# EAGLE schematic linebotOV (EAGLE 9.6.0)
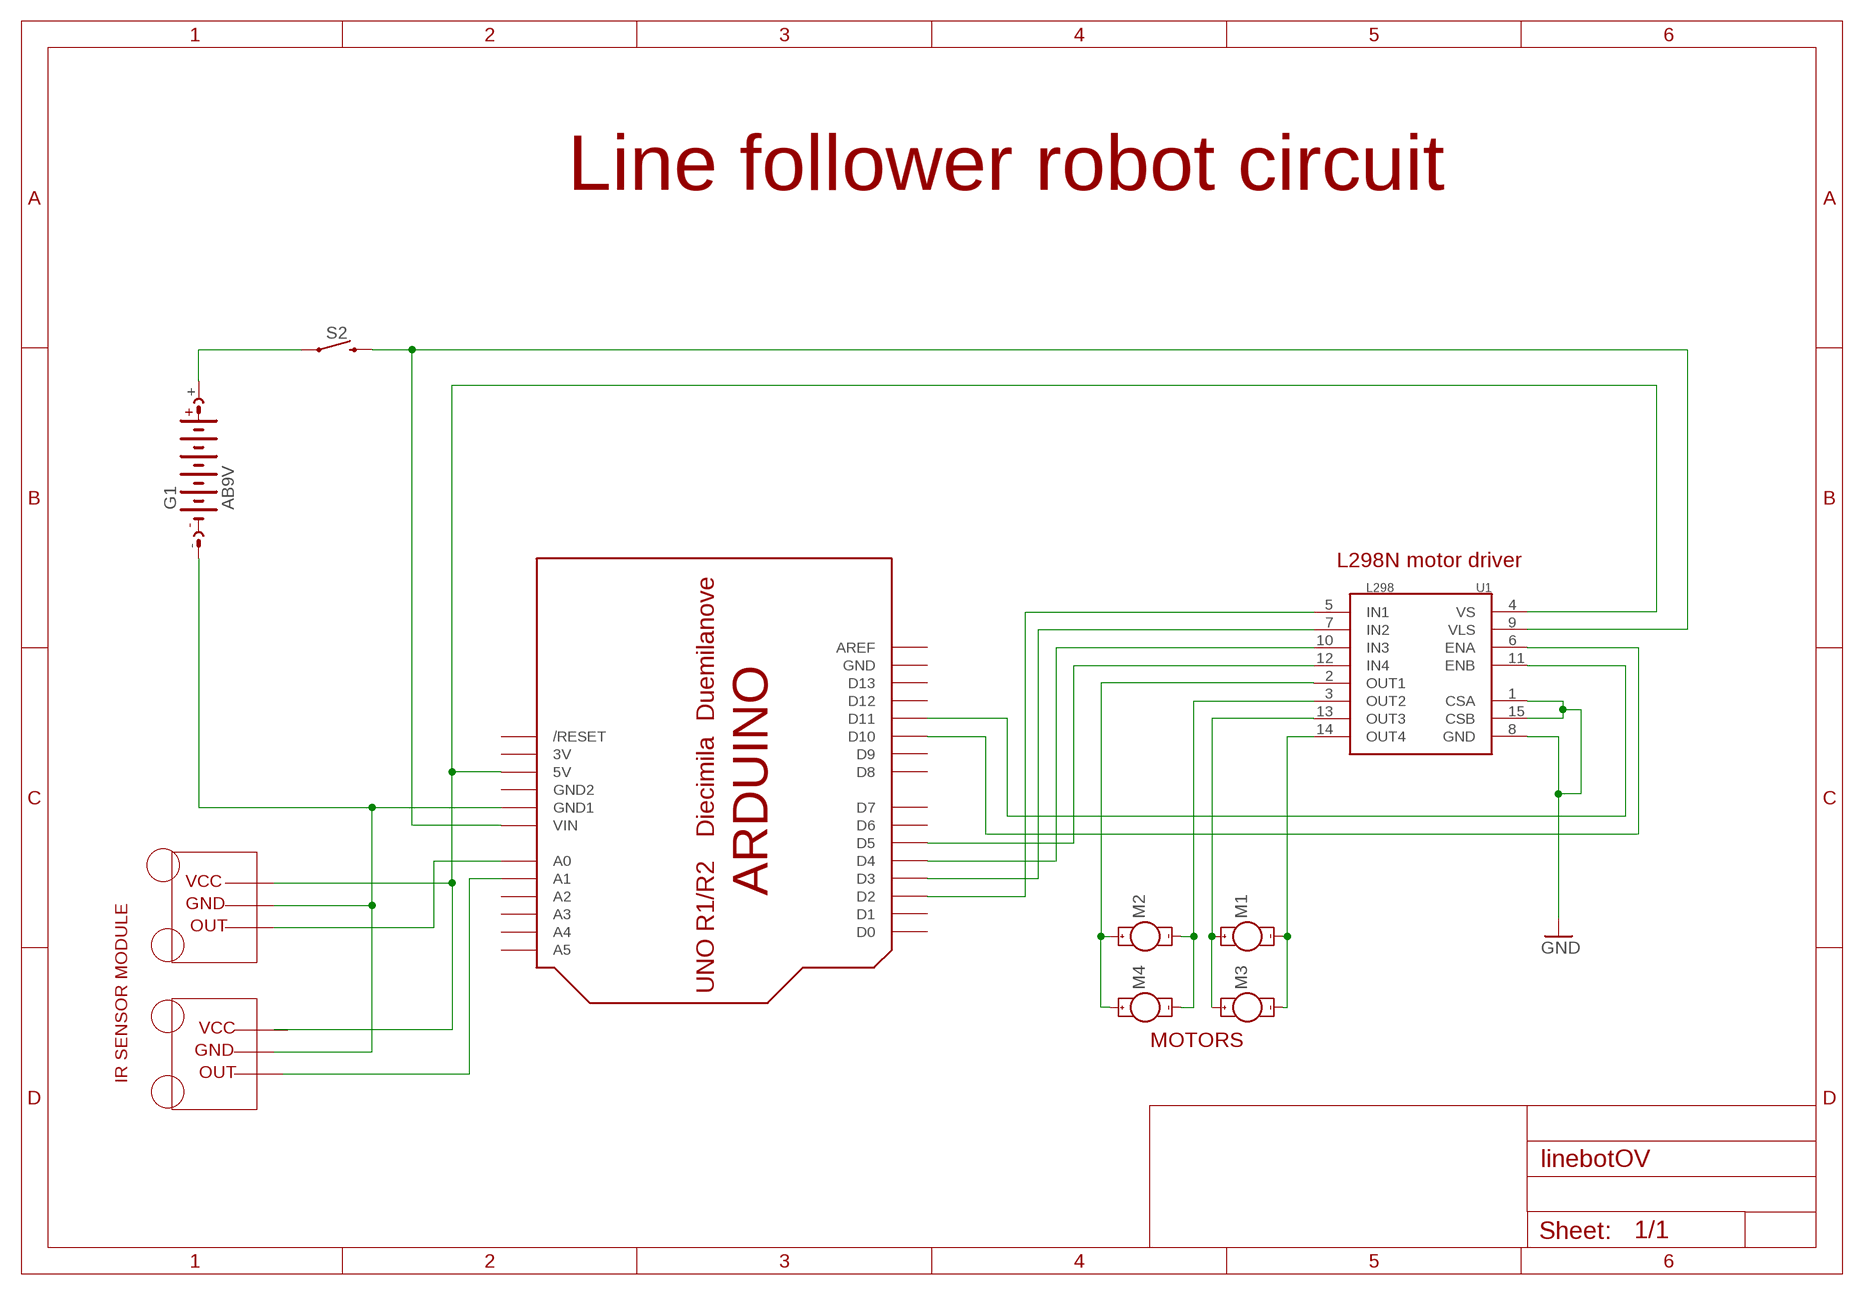
[diagram p0: schematic, sheet 1]

## Parts
G1  AB9V  [AB9V]
M1  MOTOR10MM  [VIBE-MOTOR-10MM]
M2  MOTOR10MM  [VIBE-MOTOR-10MM]
M3  MOTOR10MM  [VIBE-MOTOR-10MM]
M4  MOTOR10MM  [VIBE-MOTOR-10MM]
S2  MOMENTARY-SWITCH-SPST-PTH-6.0MM  [TACTILE_SWITCH_PTH_6.0MM]
U1  L298  [MULTIWATT15]
U$1  ARDUINO-BPLACE  [ARDUINO-BPLACE]

## Nets
GND: U1.1(CSA) U1.8(GND) U1.15(CSB)
N$1: U1.5(IN1) U$1.D2
N$2: U1.7(IN2) U$1.D3
N$3: U1.10(IN3) U$1.D4
N$4: U1.12(IN4) U$1.D5
N$5: U1.6(ENA) U$1.D10
N$6: U1.11(ENB) U$1.D11
N$7: M2.+ M4.+ U1.2(OUT1)
N$8: M2.- M4.- U1.3(OUT2)
N$9: G1.+ S2.1
N$10: S2.3 U1.9(VLS) U$1.VIN
N$11: M1.+ M3.+ U1.13(OUT3)
N$12: M1.- M3.- U1.14(OUT4)
N$13: G1.- U$1.GND1
N$14: U1.4(VS) U$1.5V
N$16: U$1.A0
N$17: U$1.A1
Unconnected: U$1.A2 U$1.A3 U$1.A4 U$1.A5 U$1.AREF U$1.D0 U$1.D1 U$1.D6 U$1.D7 U$1.D8 U$1.D9 U$1.D12 U$1.D13 U$1.RESET(/RESET)

## Notes on the sheet
- Line follower robot circuit
- L298N motor driver
- VCC
- GND
- OUT
- VCC
- MOTORS
- GND
- IR SENSOR MODULE | OUT

## Power pins joined to a net without a drawn wire
3V: U$1.3V
GND: U$1.GND
GND2: U$1.GND2

## Library data of the parts
G1 = battery:AB9V: 9-V BATTERY CLIP
M1-M4 = SparkFun-Electromechanical:MOTOR: Motor (Single-Phase) Two-terminal, single-phase motors. SparkFun Products Vibration Motor <https://www.sparkfun.com/products/8449> (ROB-08449) Physical dimension and wire connections for this powerful vibration motor. Motor has a self adhesive backing.; PROD_ID: COMP-08572; SF_SKU: ROB-08449
S2 = SparkFun-Switches:MOMENTARY-SWITCH-SPST: Momentary Switch (Pushbutton) - SPST Normally-open (NO) SPST momentary switches (buttons, pushbuttons). Variants PTH-12MM - 12mm square, through-hole Momentary Pushbutton Switch - 12mm Square <https://www.sparkfun.com/products/9190> (COM-09190) PTH-6.0MM, PTH-6.0MM-KIT - 6.0mm square, through-hole Mini Pushbutton Switch <https://www.sparkfun.com/products/97> (COM-00097) KIT package intended for soldering kit's - only one side of pads' copper is exposed. PTH-RIGHT-ANGLE-KIT - Right-angle, through-hole Right Angle Tactile Button <https://www.sparkfun.com/products/10791> - Used on SparkFun BigTime Watch Kit <https://www.sparkfun.com/products/11734> SMD-12MM - 12mm square, surface-mount Tactile Button - SMD (12mm) <https://www.sparkfun.com/products/12993> (COM-12993) Used on SparkFun PicoBoard <https://www.sparkfun.com/products/11888> SMD-4.5MM - 4.5mm Square Trackball Switch Used on SparkFun Blackberry Trackballer Breakout <https://www.sparkfun.com/products/13169> SMD-4.6MMX2.8MM - 4.60mm x 2.80mm, surface mount Used on SparkFun SAMD21 Mini Breakout <https://www.sparkfun.com/products/13664> SMD-5.2MM, SMD-5.2-REDUNDANT - 5.2mm square, surface-mount Mini Pushbutton Switch - SMD <https://www.sparkfun.com/products/8720> (COM-08720) Used on Arduino Pro Mini <https://www.sparkfun.com/products/11114> REDUNDANT package connects both switch circuits together SMD-6.0X3.5MM - 6.0 x 3.5mm, surface mount Momentary Reset Switch SMD <https://www.sparkfun.com/products/8229> (COM-08229) SMD-6.2MM-TALL - 6.2mm square, surface mount Tactile Button - SMD (6mm) <https://www.sparkfun.com/products/12992> Used on SparkFun Digital Sandbox <https://www.sparkfun.com/products/12651> SMD-RIGHT-ANGLE - Right-angle, surface mount Used on SparkFun Block for Intel® Edison - Arduino <https://www.sparkfun.com/products/13036>; PROD_ID: SWCH-08441; SF_SKU: COM-00097
U1 = SparkFun-IC-Special-Function:L298: L298 Dual Full Bridge Driver
U$1 = adafruit:ARDUINO: Arduino Diecimila/Duemilanove Make a shield with ease, this package has all the named pins as well as the two mounting drill holes and an outline of the USB and DC power connector. The outline is on the DIMENSION layer, so if your board house uses it they will cut the outline to match. http://www.ladyada.net/library/pcb/eaglelibrary.html